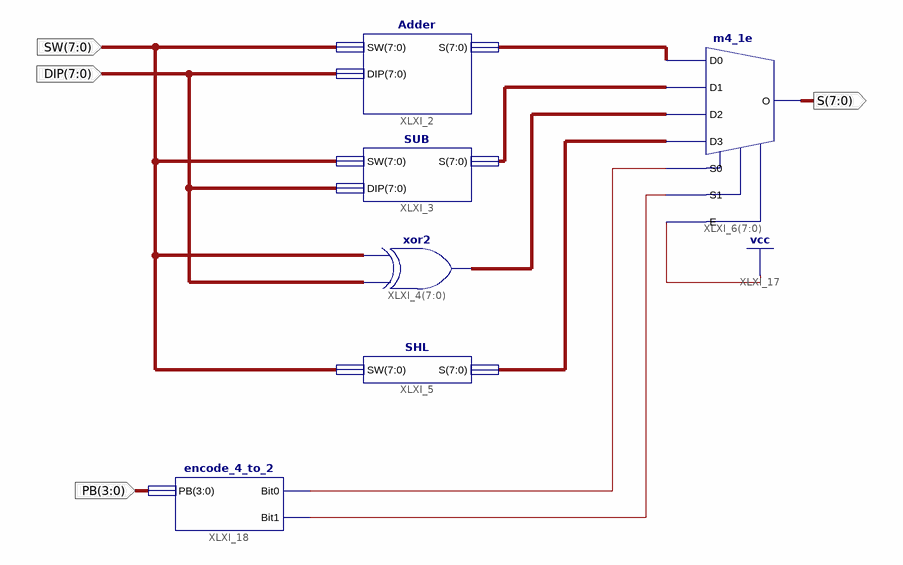
[diagram p0: schematic sheet 1]
// Xilinx ISE schematic operation.sch (spartan6) as structural Verilog: 6 symbols, 4 ports
module operation (
  input  [7:0] SW,
  input  [7:0] DIP,
  input  [3:0] PB,
  output [7:0] S
);

  wire XLXN_28, XLXN_30;
  wire [7:0] XLXN_7, XLXN_8, XLXN_9, XLXN_10;

  SHL XLXI_5 (.SW(SW), .S(XLXN_10));
  assign XLXN_9 = DIP ^ SW;  // xor2 XLXI_4[7..0], 8 bits wide
  SUB XLXI_3 (.SW(SW), .DIP(DIP), .S(XLXN_8));
  Adder XLXI_2 (.SW(SW), .DIP(DIP), .S(XLXN_7));
  m4_1e XLXI_6[7:0] (.D0(XLXN_7), .D1(XLXN_8), .D2(XLXN_9), .D3(XLXN_10), .E(1'b1), .S0(XLXN_28), .S1(XLXN_30), .O(S));
  encode_4_to_2 XLXI_18 (.PB(PB), .Bit0(XLXN_28), .Bit1(XLXN_30));
endmodule
